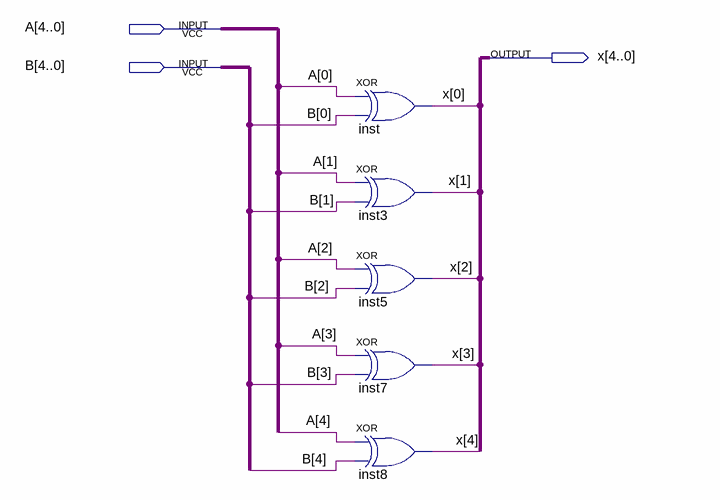
[diagram p0: schematic sheet]
// Quartus schematic FuncaoXOR.bdf as structural Verilog: 5 symbols, 3 pins
module FuncaoXOR (
  input  [4:0] A,
  input  [4:0] B,
  output [4:0] x
);

  xor inst (x[0], A[0], B[0]);
  xor inst3 (x[1], A[1], B[1]);
  xor inst5 (x[2], A[2], B[2]);
  xor inst7 (x[3], A[3], B[3]);
  xor inst8 (x[4], A[4], B[4]);
endmodule
